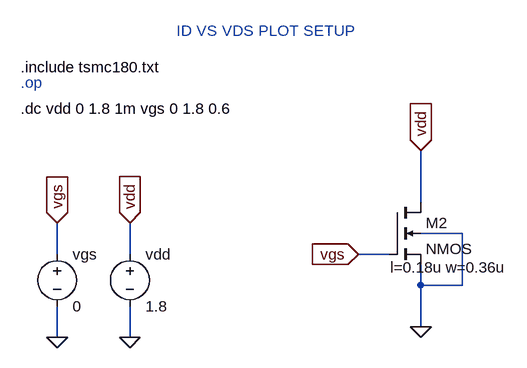
[diagram p0: schematic Setup_Id_vs_Vds_nmos.asc]
Setup_Id_vs_Vds_nmos.asc, the LTspice schematic file:
Version 4
SHEET 1 880 680
WIRE -480 160 -480 80
WIRE -416 208 -480 208
WIRE -1040 240 -1040 192
WIRE -928 240 -928 192
WIRE -528 240 -576 240
WIRE -480 288 -480 256
WIRE -416 288 -416 208
WIRE -416 288 -480 288
WIRE -480 352 -480 288
WIRE -1040 368 -1040 320
WIRE -928 368 -928 320
FLAG -480 352 0
FLAG -1040 368 0
FLAG -1040 192 vgs
IOPIN -1040 192 In
FLAG -576 240 vgs
IOPIN -576 240 In
FLAG -928 368 0
FLAG -928 192 vdd
IOPIN -928 192 In
FLAG -480 80 vdd
IOPIN -480 80 In
SYMBOL nmos4 -528 160 R0
WINDOW 123 1 100 Left 2
SYMATTR Value2 l=0.18u w=0.36u
SYMATTR InstName M2
SYMBOL voltage -1040 224 R0
WINDOW 123 0 0 Left 0
WINDOW 39 0 0 Left 0
SYMATTR InstName vgs
SYMATTR Value 0
SYMBOL voltage -928 224 R0
WINDOW 123 0 0 Left 0
WINDOW 39 0 0 Left 0
SYMATTR InstName vdd
SYMATTR Value 1.8
TEXT -1096 -24 Left 2 ;.op
TEXT -1096 -48 Left 2 !.include tsmc180.txt
TEXT -1096 16 Left 2 !.dc vdd 0 1.8 1m vgs 0 1.8 0.6
TEXT -856 -104 Left 2 ;ID VS VDS PLOT SETUP

The netlist it stands for:
* Setup_Id_vs_Vds_nmos.asc
M2 vdd vgs 0 0 NMOS l=0.18u w=0.36u
vgs vgs 0 0
vdd vdd 0 1.8
.model NMOS NMOS
.model PMOS PMOS
.lib standard.mos
* .op
.include tsmc180.txt
.dc vdd 0 1.8 1m vgs 0 1.8 0.6
* ID VS VDS PLOT SETUP
.backanno
.end